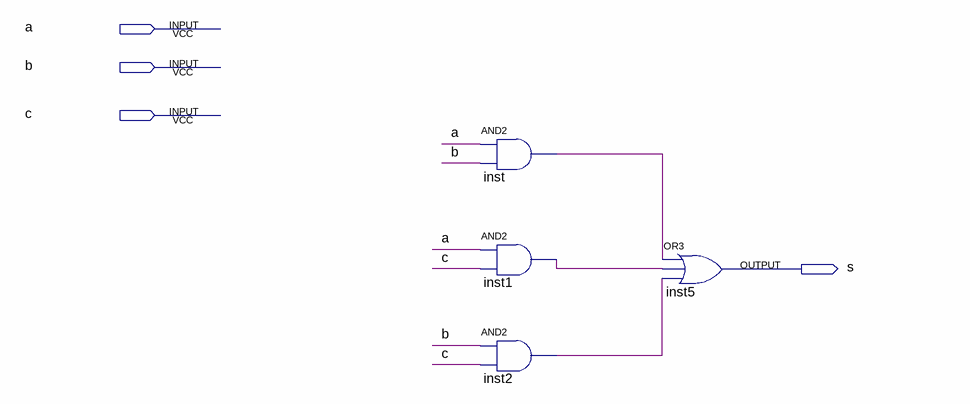
[diagram p0: schematic sheet]
// Quartus schematic maj3.bdf as structural Verilog: 4 symbols, 4 pins
module maj3 (
  input  a,
  input  b,
  input  c,
  output s
);

  wire inst1_out, inst2_out, inst_out;

  and inst (inst_out, a, b);
  and inst1 (inst1_out, a, c);
  and inst2 (inst2_out, b, c);
  or inst5 (s, inst_out, inst1_out, inst2_out);
endmodule
